# Altium schematic sheet P01_COVER.SchDoc
size 297 x 209 mm
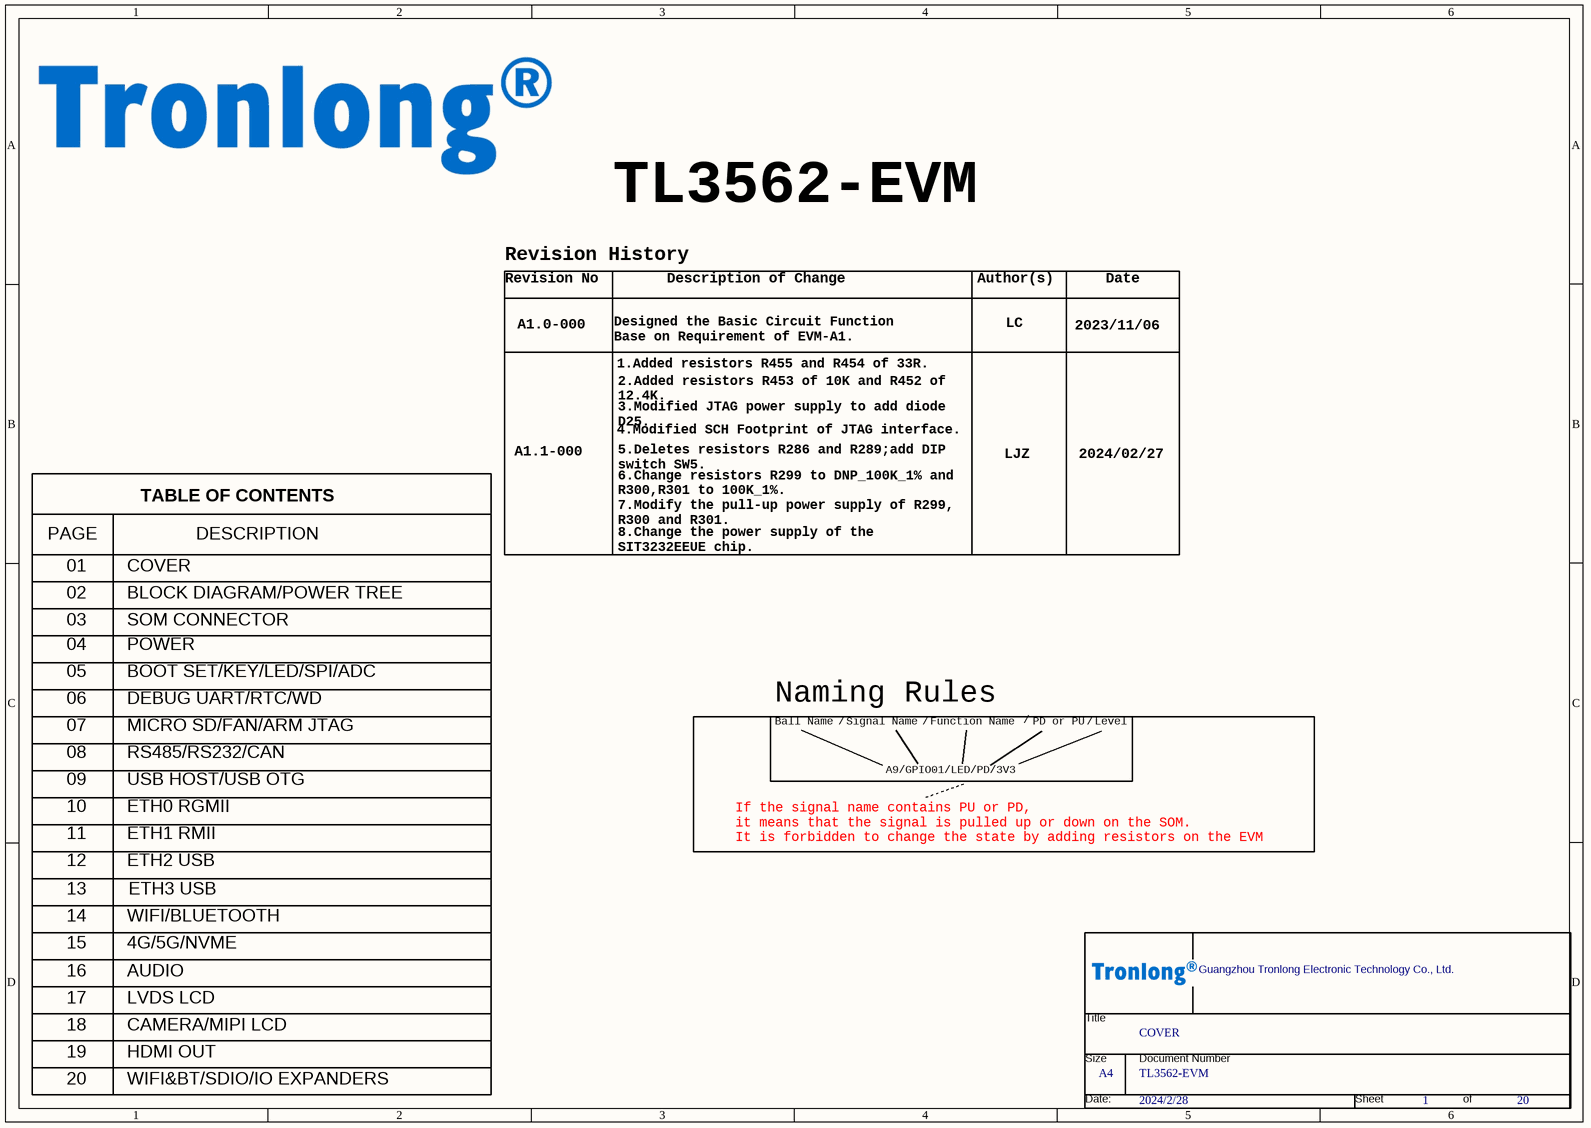
[diagram p0: P01_COVER.SchDoc]

## Parts
*  Page Count: 20  Page Number: 1  Page Size: A4  OrgName: Guangzhou Tronlong Electronic Technology Co., Ltd.  Title: COVER  Doc: TL3562-EVM  Page Modify Date: 2024/2/28  (hidden comment: Tronlong_TITTLE_20211115)  (graphical)

## Notes on the sheet
- Revision History
- TL3562-EVM
- Revision No
- A1.0-000
- Designed the Basic Circuit Function
  Base on Requirement of EVM-A1.
- Description of Change
- Author(s)
- LC
- 2023/11/06
- Date
- 1.Added resistors R455 and R454 of 33R.
- 2.Added resistors R453 of 10K and R452 of
  12.4K.
- A1.1-000
- 3.Modified JTAG power supply to add diode
  D25.
- 5.Deletes resistors R286 and R289;add DIP
  switch SW5.
- 4.Modified SCH Footprint of JTAG interface.
- LJZ
- 2024/02/27
- PAGE
- TABLE OF CONTENTS
- DESCRIPTION
- 6.Change resistors R299 to DNP_100K_1% and
  R300,R301 to 100K_1%.
- 7.Modify the pull-up power supply of R299,
  R300 and R301.
- 02
- 01
- BLOCK DIAGRAM/POWER TREE
- COVER
- 8.Change the power supply of the
  SIT3232EEUE chip.
- 04
- 03
- POWER
- SOM CONNECTOR
- 07
- 06
- 05
- BOOT SET/KEY/LED/SPI/ADC
- DEBUG UART/RTC/WD
- MICRO SD/FAN/ARM JTAG
- Ball Name
- Naming Rules
- /
- Signal Name
- Function Name
- PD or PU
- Level
- 08
- 09
- USB HOST/USB OTG
- RS485/RS232/CAN
- A9/GPIO01/LED/PD/3V3
- 10
- 12
- 11
- ETH0 RGMII
- ETH1 RMII
- ETH2 USB
- If the signal name contains PU or PD,
  it means that the signal is pulled up or down on the SOM.
  It is forbidden to change the state by adding resistors on the EVM
- 13
- 14
- WIFI/BLUETOOTH
- ETH3 USB
- 15
- 16
- 17
- LVDS LCD
- AUDIO
- 4G/5G/NVME
- 18
- 19
- CAMERA/MIPI LCD
- HDMI OUT
- 20
- WIFI&BT/SDIO/IO EXPANDERS
- (in symbol Tronlong_TITTLE_20211115) Title; Size; Document Number; Date:; Sheet; of

## Library data of the parts
* = Tronlong_TITTLE_20211115: RevCode: A?; Page Create Date: March  8, 1995